# EAGLE schematic sensor_brd_2022 (EAGLE 9.6.2)
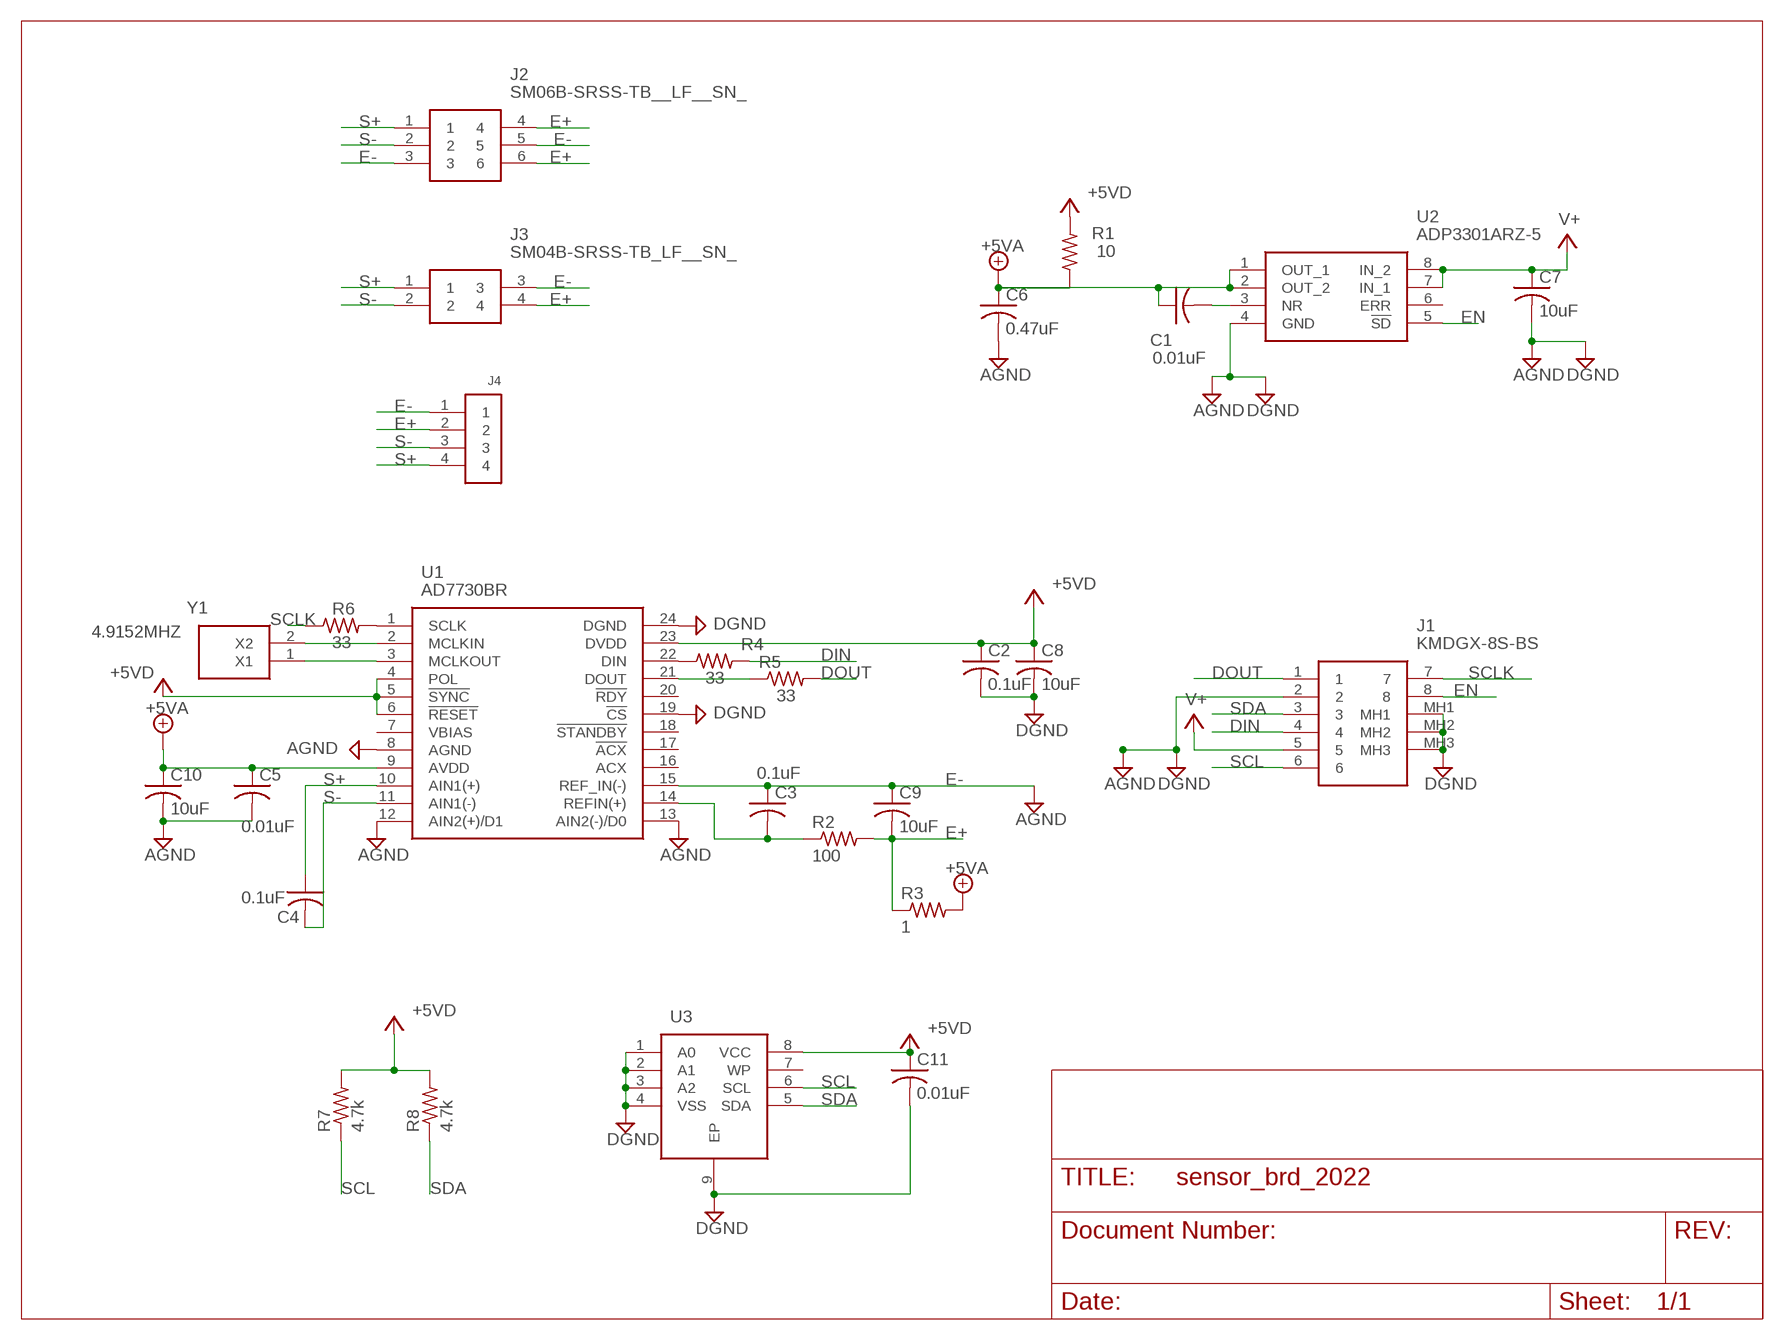
[diagram p0: schematic, sheet 1]

## Parts
C1  0.01uF  C-USC0805K  [C0805K]
C2  0.1uF  C-USC0805K  [C0805K]
C3  0.1uF  C-USC0805K  [C0805K]
C4  0.1uF  C-USC0805K  [C0805K]
C5  0.01uF  C-USC0805K  [C0805K]
C6  0.47uF  C-USC1210  [C1210]
C7  10uF  C-USC2012  [C2012]
C8  10uF  C-USC2012  [C2012]
C9  10uF  C-USC2012  [C2012]
C10  10uF  C-USC2012  [C2012]
C11  0.01uF  C-USC0805K  [C0805K]
J1  KMDGX-8S-BS  [KMDGX8SBS]
J2  SM06B-SRSS-TB__LF__SN_  [SM06B-SRSS-TB]
J3  SM04B-SRSS-TB_LF__SN_  [SM04B-SRSS-TB(LFSN)]
J4  1X4-BIG  [1X04-BIG]
R1  10  R-US_R0603  [R0603]
R2  100  R-US_R0603  [R0603]
R3  1  R-US_R0603  [R0603]
R4  33  R-US_R0603  [R0603]
R5  33  R-US_R0603  [R0603]
R6  33  R-US_R0603  [R0603]
R7  4.7k  R-US_R0603  [R0603]
R8  4.7k  R-US_R0603  [R0603]
U1  AD7730BR  [SOIC127P1032X265-24N]
U2  ADP3301ARZ-5  [SOIC127P600X175-8N]
U3  24AA256-I_MF  [SON127P600X500X100-9N]
Y1  4.9152MHz  9C-4.000MAAJ-T  [9C4000MAAJT]

## Nets
+5V: C2.1 C8.1 C11.1 R1.2 R7.2 R8.2 U1.4(POL) U1.5(!SYNC) U1.6(!RESET) U1.23(DVDD) U3.8(VCC)
+5V/1: C1.1 C5.1 C6.1 C10.1 R1.1 R3.2 U1.9(AVDD) U2.1(OUT_1) U2.2(OUT_2)
AGND: C5.2 C6.2 C10.2 U1.8(AGND) U1.12(AIN2(+)/D1) U1.13(AIN2(-)/D0)
DGND: C2.2 C7.2 C8.2 C11.2 J1.2 J1.MH1 J1.MH2 J1.MH3 U1.19(!CS) U1.24(DGND) U2.4(GND) U3.1(A0) U3.2(A1) U3.3(A2) U3.4(VSS) U3.9(EP) ; supply symbol labelled AGND
DIN: J1.4 R4.2
DOUT: J1.1 R5.2
E+: C9.2 J2.4 J2.6 J3.4 J4.2 R2.2 R3.1
E-: C3.1 C9.1 J2.3 J2.5 J3.3 J4.1 U1.15(REF_IN(-)) ; supply symbol labelled AGND
EN: J1.8 U2.5(!SD)
N$1: C1.2 U2.3(NR)
N$2: U1.2(MCLKIN) Y1.2(X2)
N$3: U1.3(MCLKOUT) Y1.1(X1)
N$4: R4.1 U1.22(DIN)
N$5: C3.2 R2.1 U1.14(REFIN(+))
N$6: R6.2 U1.1(SCLK)
N$8: R5.1 U1.21(DOUT)
S+: C4.1 J2.1 J3.1 J4.4 U1.10(AIN1(+))
S-: C4.2 J2.2 J3.2 J4.3 U1.11(AIN1(-))
SCL: J1.6 R7.1 U3.6(SCL)
SCLK: J1.7 R6.1
SDA: J1.3 R8.1 U3.5(SDA)
V+: C7.1 J1.5 U2.7(IN_1) U2.8(IN_2)
Unconnected: U1.7(VBIAS) U1.16(ACX) U1.17(!ACX) U1.18(!STANDBY) U1.20(!RDY) U2.6(ERR) U3.7(WP)

## Library data of the parts
C1-C11 = adafruit:C-US: CAPACITOR, American symbol
J1 = SamacSys_Parts:KMDGX-8S-BS: Circular DIN Connectors 8P R/A FULL SHIELD GOLD PLATED Source: Datasheet <https://componentsearchengine.com/Datasheets/1/KMDGX-8S-BS.pdf>; DESCRIPTION: Circular DIN Connectors 8P R/A FULL SHIELD GOLD PLATED; HEIGHT: 13.3mm; MANUFACTURER_NAME: Kycon; MANUFACTURER_PART_NUMBER: KMDGX-8S-BS; MOUSER_PART_NUMBER: 806-KMDGX-8S-BS; MOUSER_PRICE-STOCK: https://www.mouser.co.uk/ProductDetail/Kycon/KMDGX-8S-BS?qs=cuz0Kzc%2FkGBSI5WmI9vUiw%3D%3D
J2 = SamacSys_Parts:SM06B-SRSS-TB__LF__SN_: connector,multipole PCB use,SM06B-SRSS-T JST SH Series, 1mm Pitch 6 Way 1 Row Right Angle PCB Header, Solder Termination, 1A Source: Datasheet; DESCRIPTION: connector,multipole PCB use,SM06B-SRSS-T JST SH Series, 1mm Pitch 6 Way 1 Row Right Angle PCB Header, Solder Termination, 1A; HEIGHT: mm; MANUFACTURER_NAME: JST (JAPAN SOLDERLESS TERMINALS); MANUFACTURER_PART_NUMBER: SM06B-SRSS-TB (LF)(SN)
J3 = SamacSys_Parts:SM04B-SRSS-TB_LF__SN_: JST (JAPAN SOLDERLESS TERMINALS) - SM04B-SRSS-TB(LF)(SN) - CONNECTOR, HEADER, SMT, R/A, 1MM, 4WAY Source: Datasheet <http://www.jst-mfg.com/product/pdf/eng/eSH.pdf>; DESCRIPTION: JST (JAPAN SOLDERLESS TERMINALS) - SM04B-SRSS-TB(LF)(SN) - CONNECTOR, HEADER, SMT, R/A, 1MM, 4WAY; HEIGHT: mm; MANUFACTURER_NAME: JST (JAPAN SOLDERLESS TERMINALS); MANUFACTURER_PART_NUMBER: SM04B-SRSS-TB(LF)(SN)
J4 = adafruit:1X4: 4-pin connector
R1-R8 = adafruit:R-US_: RESISTOR, American symbol
U1 = SamacSys_Parts:AD7730BR: Analog to Digital Converters - ADC CMOS 24-Bit Bridge Transducer Source: Datasheet <https://componentsearchengine.com/Datasheets/1/AD7730BR.pdf>; DESCRIPTION: Analog to Digital Converters - ADC CMOS 24-Bit Bridge Transducer; HEIGHT: 2.65mm; MANUFACTURER_NAME: Analog Devices; MANUFACTURER_PART_NUMBER: AD7730BR; MOUSER_PART_NUMBER: 584-AD7730BR; MOUSER_PRICE-STOCK: https://www.mouser.com/Search/Refine.aspx?Keyword=584-AD7730BR
U2 = SamacSys_Parts:ADP3301ARZ-5: LDO Regulator 5V 0.2A 8-Pin SOIC Source: Datasheet <https://www.mouser.de/datasheet/2/609/ADP3301-878912.pdf>; DESCRIPTION: LDO Regulator 5V 0.2A 8-Pin SOIC; HEIGHT: 1.75mm; MANUFACTURER_NAME: Analog Devices; MANUFACTURER_PART_NUMBER: ADP3301ARZ-5; MOUSER_PART_NUMBER: 584-ADP3301ARZ-5
U3 = SamacSys_Parts:24AA256-I_MF: 256K 32Kx8 1.8V Ser. EEPROM,24AA256-I/MF Source: Datasheet <http://ww1.microchip.com/downloads/en/DeviceDoc/20001203U.pdf>; DESCRIPTION: 256K 32Kx8 1.8V Ser. EEPROM,24AA256-I/MF; HEIGHT: 1mm; MANUFACTURER_NAME: Microchip; MANUFACTURER_PART_NUMBER: 24LC256-I/MF; MOUSER_PART_NUMBER: 579-24AA256-I/MF; MOUSER_PRICE-STOCK: https://www.mouser.co.uk/ProductDetail/Microchip-Technology/24AA256-I-MF?qs=Sez7gRs8XSWcP7qgmBnMNQ%3D%3D
Y1 = SamacSys_Parts:9C-4.000MAAJ-T: Crystal 4MHz +/-30ppm (Tol) +/-30ppm (Stability) 18pF FUND 150Ohm 2-Pin HC-49/S SMD T/R Source: Datasheet <https://componentsearchengine.com/Datasheets/2/9C-4.000MAAJ-T.pdf>; DESCRIPTION: Crystals CRYSTAL 4.9152MHZ 20PF SMD,CSM-7X-DN,+/-100ppm,+/-30ppm,20pF,150 Ohm,Fundamental,-40 C 85 C,HC49/US,0.449" L x 0.189" W (11.40mm x 4.80mm),0.169" (4.30mm); FREQ: 4.9152MHZ; HEIGHT: 4.3mm; MANUFACTURER_NAME: ECS; MANUFACTURER_PART_NUMBER: ECS-049-20-5PXDN-TR; MOUSER_PART_NUMBER: 520-049-20-5PXDN-TR; MOUSER_PRICE-STOCK: https://www.mouser.com/ProductDetail/ECS/ECS-049-20-5PXDN-TR?qs=u8ePFVghNnQG%2FqmG9wvQ8w%3D%3D